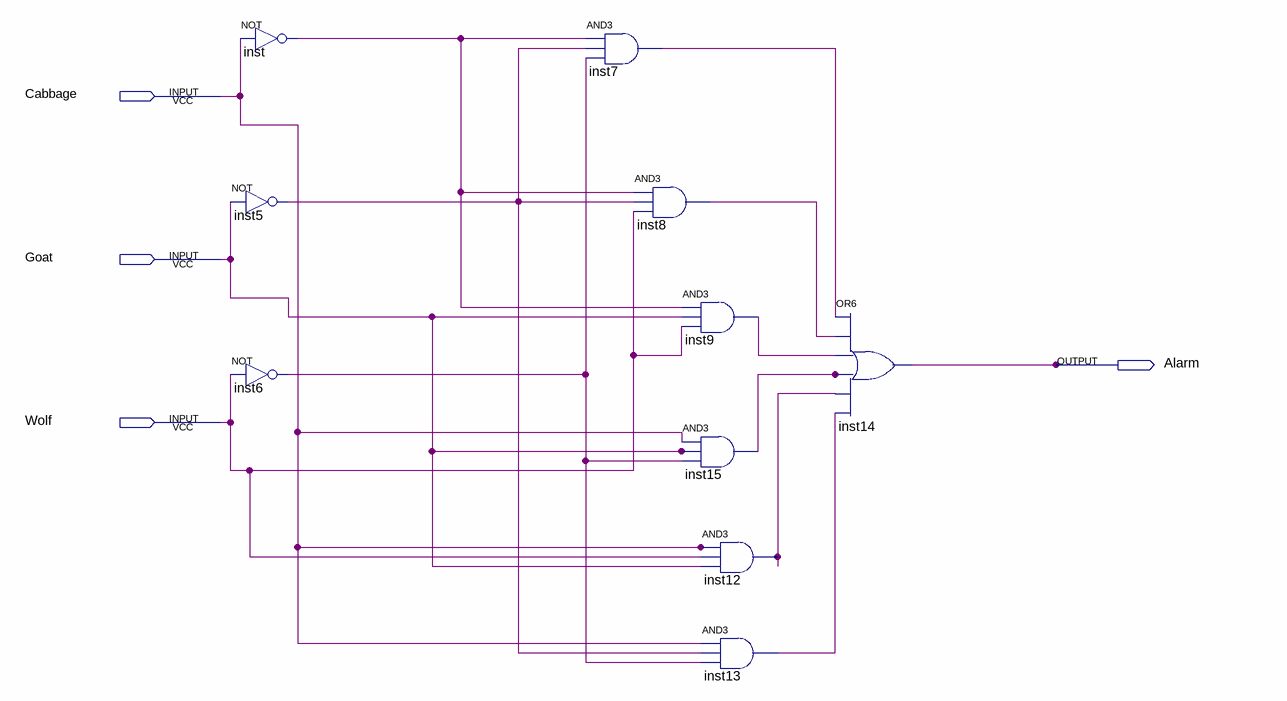
[diagram p0: schematic sheet]
// Quartus schematic lab2step2.bdf as structural Verilog: 10 symbols, 4 pins
module lab2step2 (
  input  Cabbage,
  input  Goat,
  input  Wolf,
  output Alarm
);

  wire inst5_out, inst6_out, inst7_out, inst8_out, inst9_out, inst12_out, inst13_out, inst15_out, inst_out;

  not inst (inst_out, Cabbage);
  not inst5 (inst5_out, Goat);
  not inst6 (inst6_out, Wolf);
  and inst7 (inst7_out, inst_out, inst5_out, inst6_out);
  and inst8 (inst8_out, inst_out, inst5_out, Wolf);
  and inst9 (inst9_out, inst_out, Goat, Wolf);
  and inst15 (inst15_out, Cabbage, Goat, inst6_out);
  and inst12 (inst12_out, Cabbage, Wolf, Goat);
  and inst13 (inst13_out, Cabbage, inst5_out, inst6_out);
  or inst14 (Alarm, inst7_out, inst8_out, inst9_out, inst15_out, inst12_out, inst13_out);
endmodule
